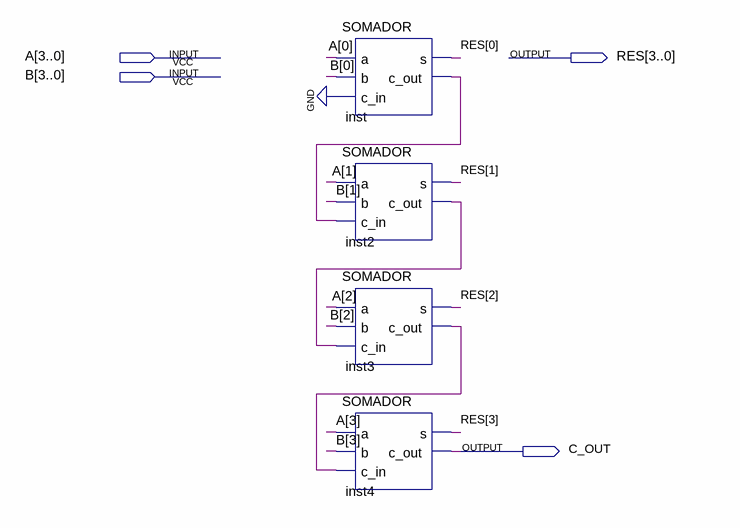
[diagram p0: schematic sheet]
// Quartus schematic SOMADOR4.bdf as structural Verilog: 4 symbols, 4 pins
module SOMADOR4 (
  input  [3:0] A,
  input  [3:0] B,
  output [3:0] RES,
  output C_OUT
);

  wire inst2_c_out, inst3_c_out, inst_c_out;

  SOMADOR inst (.a(A[0]), .b(B[0]), .c_in(1'b0), .s(RES[0]), .c_out(inst_c_out));
  SOMADOR inst2 (.a(A[1]), .b(B[1]), .c_in(inst_c_out), .s(RES[1]), .c_out(inst2_c_out));
  SOMADOR inst3 (.a(A[2]), .b(B[2]), .c_in(inst2_c_out), .s(RES[2]), .c_out(inst3_c_out));
  SOMADOR inst4 (.a(A[3]), .b(B[3]), .c_in(inst3_c_out), .s(RES[3]), .c_out(C_OUT));
endmodule
